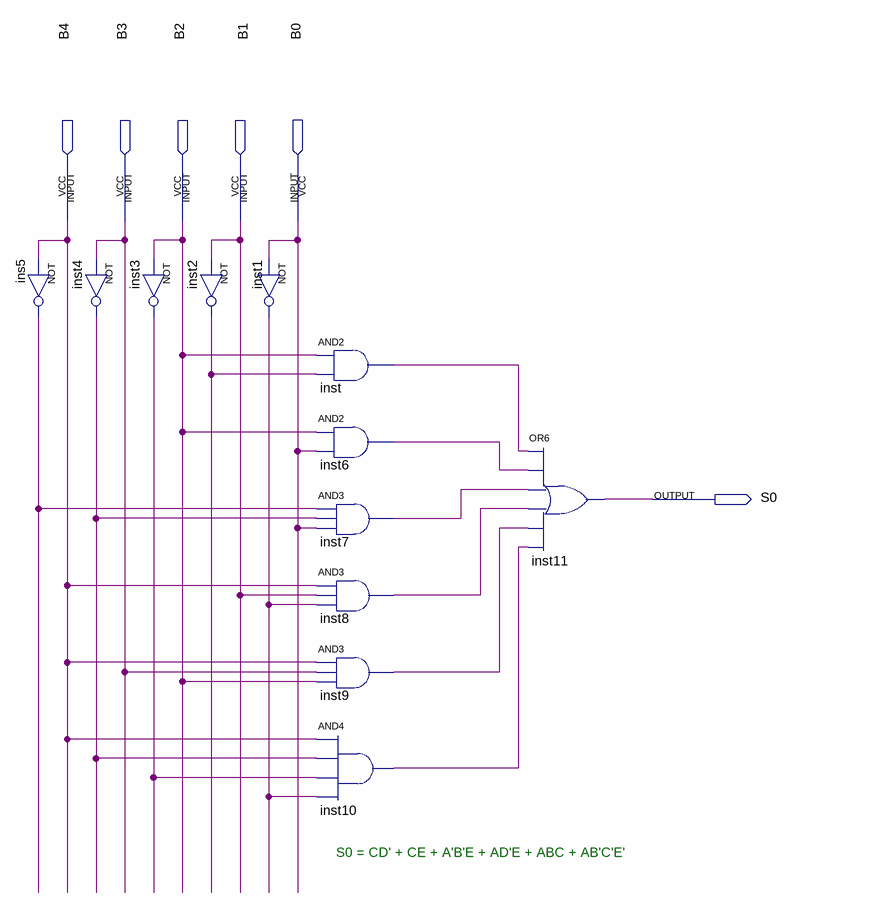
[diagram p0: schematic sheet]
// Quartus schematic Andares_Elevador_S0.bdf as structural Verilog: 12 symbols, 6 pins
module Andares_Elevador_S0 (
  input  B4,
  input  B3,
  input  B2,
  input  B1,
  input  B0,
  output S0
);

  wire ins5_out, inst1_out, inst2_out, inst3_out, inst4_out, inst6_out, inst7_out, inst8_out, inst9_out,
       inst10_out, inst_out;

  not inst4 (inst4_out, B3);
  not ins5 (ins5_out, B4);
  not inst3 (inst3_out, B2);
  not inst2 (inst2_out, B1);
  not inst1 (inst1_out, B0);
  and inst (inst_out, B2, inst2_out);
  and inst6 (inst6_out, B2, B0);
  and inst7 (inst7_out, ins5_out, inst4_out, B0);
  and inst8 (inst8_out, B4, B1, inst1_out);
  and inst9 (inst9_out, B4, B3, B2);
  and inst10 (inst10_out, B4, inst4_out, inst3_out, inst1_out);
  or inst11 (S0, inst_out, inst6_out, inst7_out, inst8_out, inst9_out, inst10_out);

  // Notes on the sheet:
  //   S0 = CD' + CE + A'B'E + AD'E + ABC + AB'C'E'
endmodule
